# EAGLE design Servo (EAGLE 7.1.0)
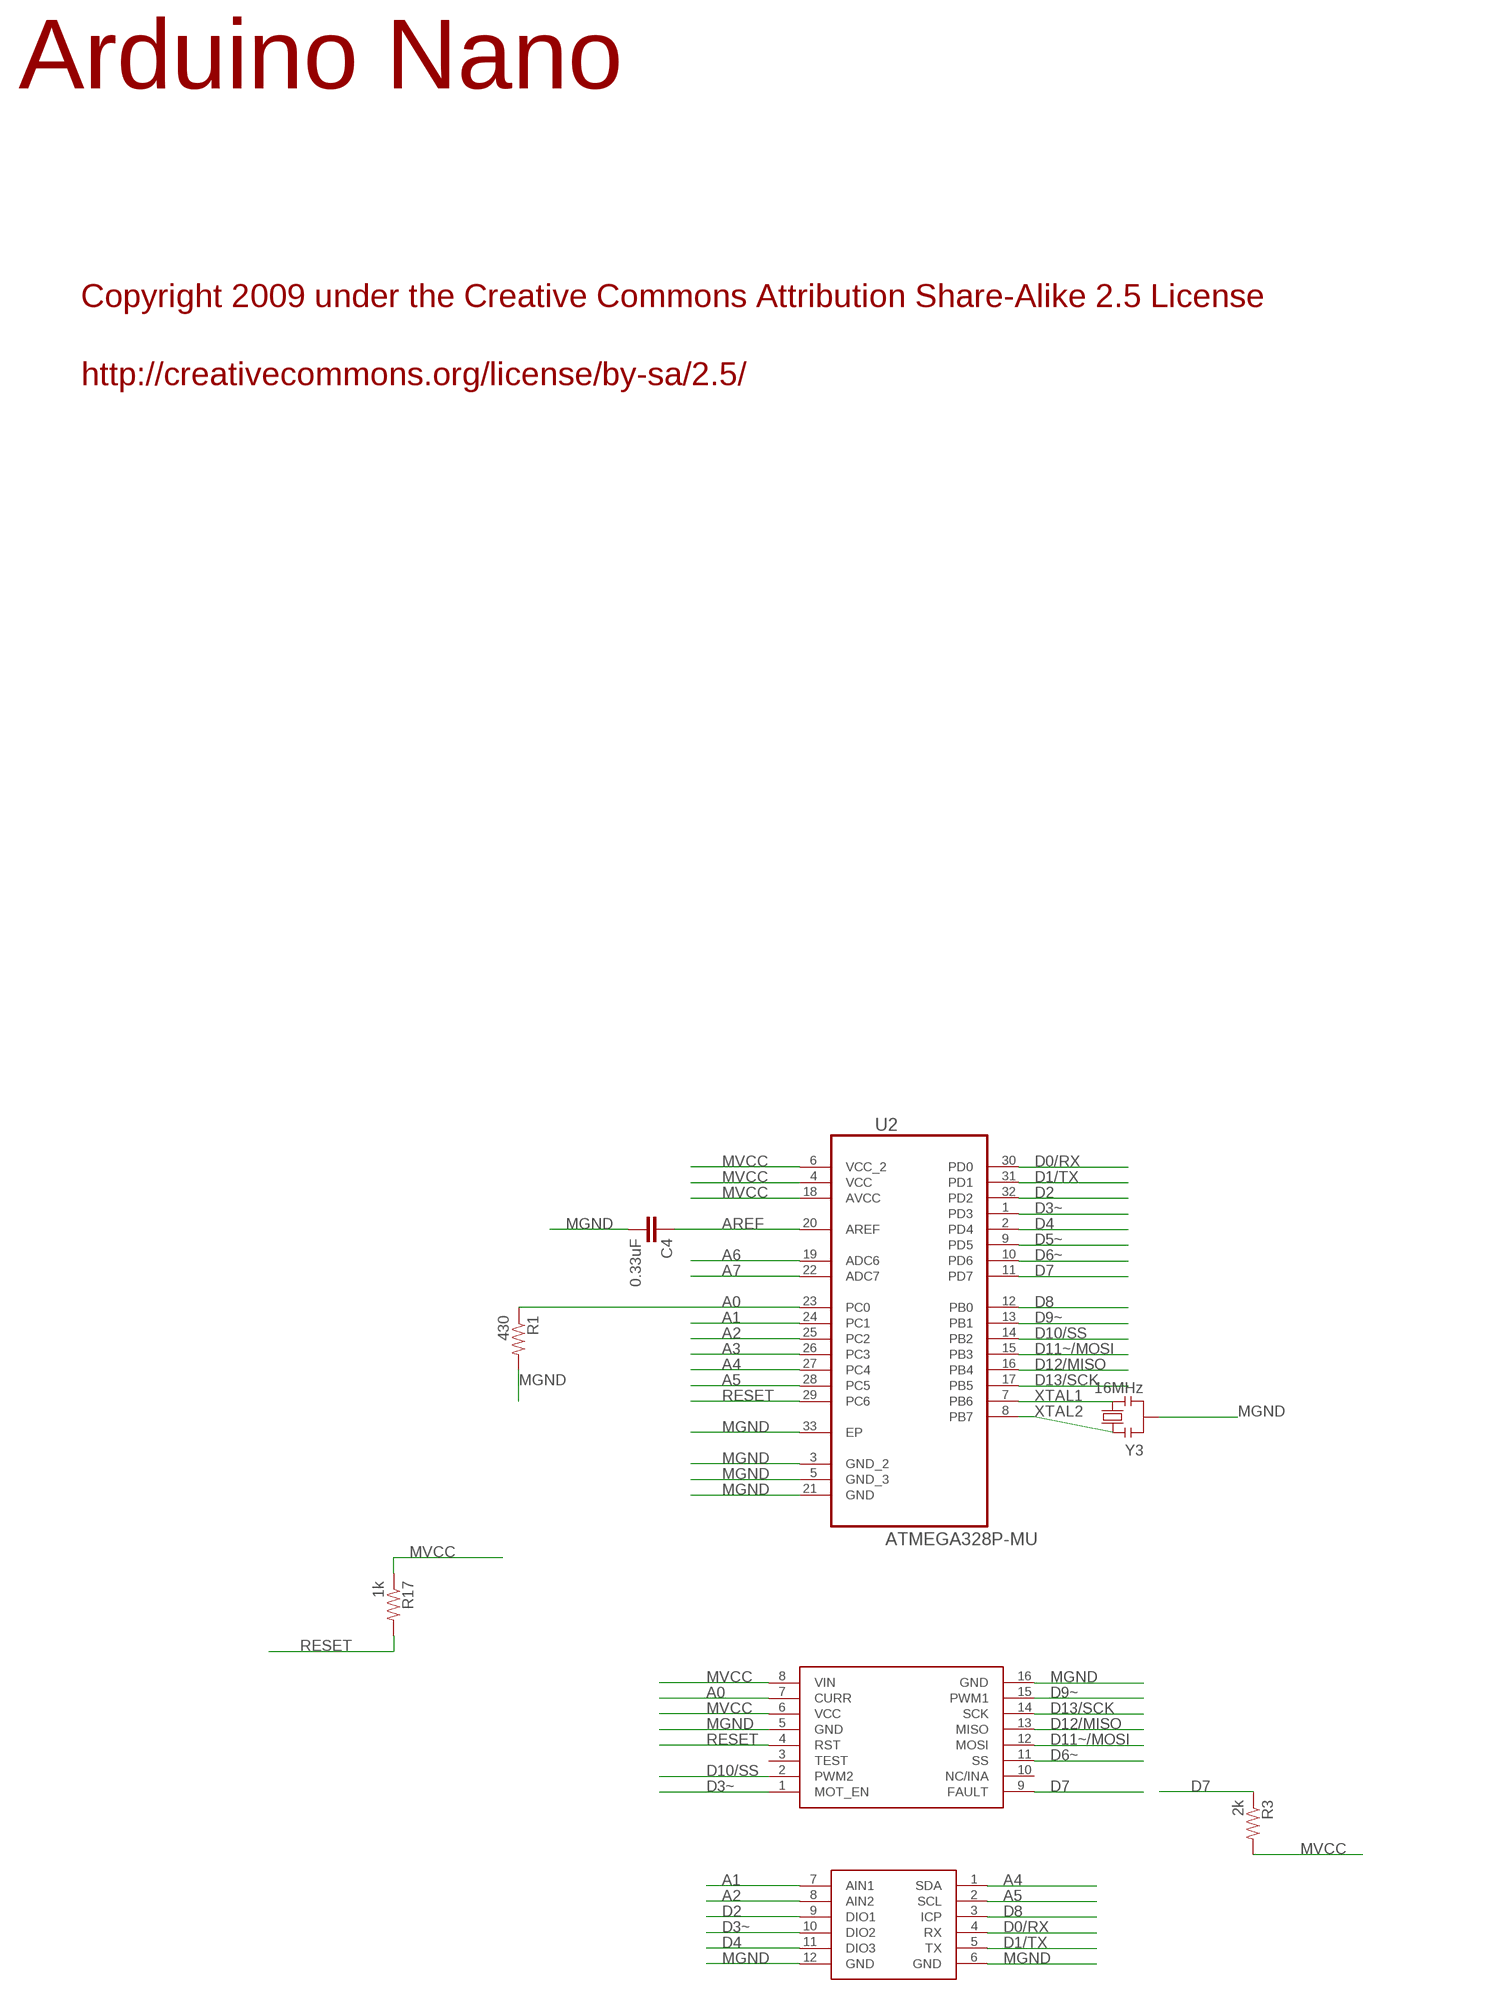
[diagram p0: schematic, sheet 1, part 1 of 2]
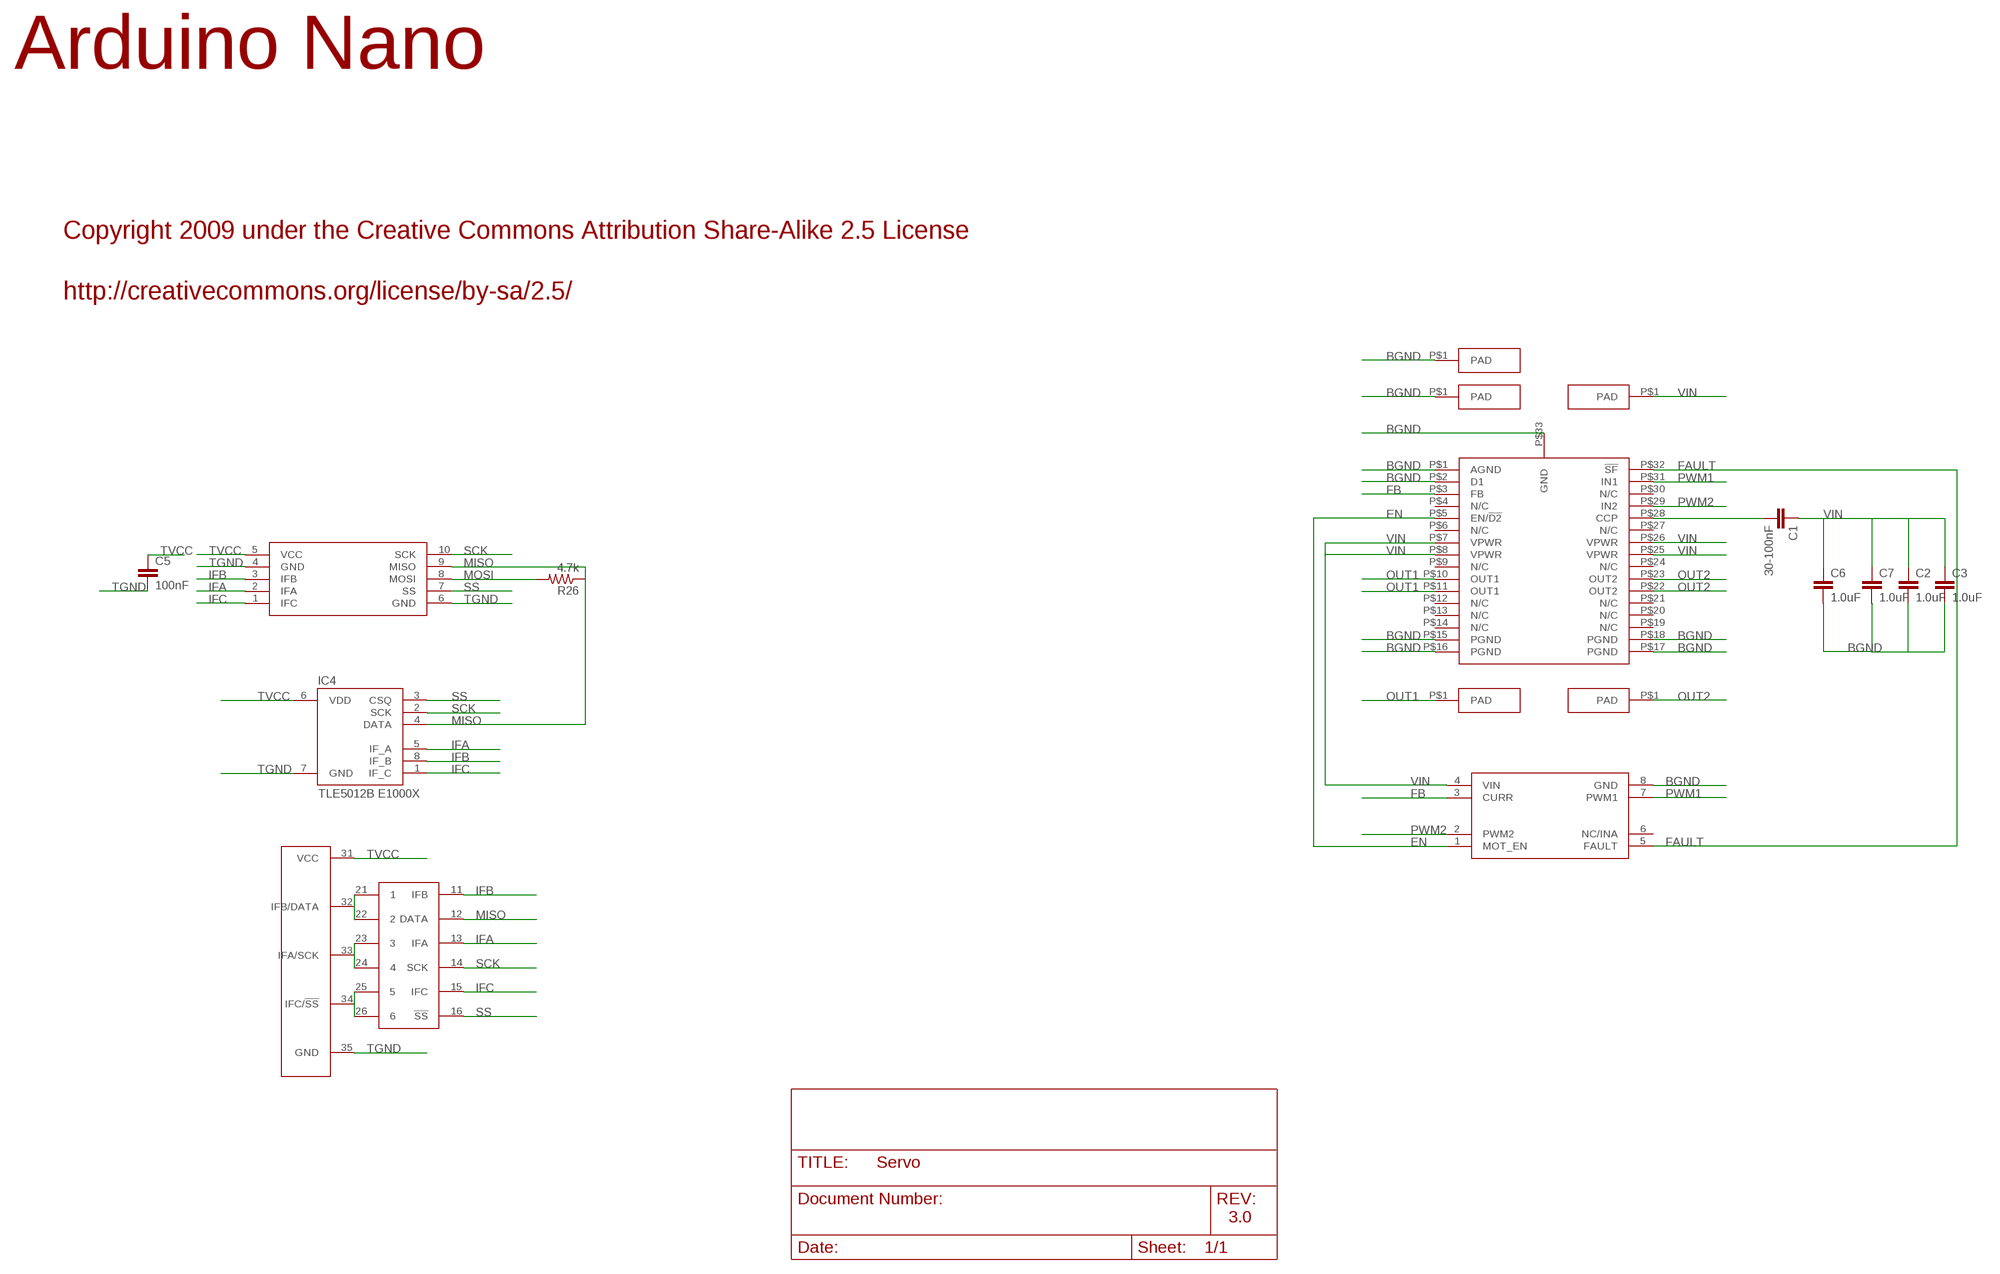
[diagram p1: schematic, sheet 1, part 2 of 2]

## Parts
C1  30-100nF  0.33UF-50V-10%(0805)  [0805-CAP]
C2  1.0uF  1.0UF50V10%(1206)  [1206-CAP]
C3  1.0uF  1.0UF50V10%(1206)  [1206-CAP]
C4  0.33uF  0.33UF-50V-10%(0805)  [0805-CAP]
C5  100nF  0.33UF-50V-10%(0805)  [0805-CAP]
C6  1.0uF  1.0UF50V10%(1206)  [1206-CAP]
C7  1.0uF  1.0UF50V10%(1206)  [1206-CAP]
IC4  TLE5012B E1000X  TLE5012B  [SO08]
R1  430  0.05OHM-1/5W-1%(0603)  [0603]
R3  2k  0.05OHM-1/5W-1%(0603)  [0603]
R17  1k  0.05OHM-1/5W-1%(0603)  [0603]
R26  4.7k  0.05OHM-1/5W-1%(0603)  [0603]
U2  ATMEGA328P-MU  [QFN50P500X500X100-33N]
U$1  MIDDLE  [MIDDLE2]
U$2  TOP  [TOP]
U$3  BOTTOM  [BOTTOM]
U$4  MC34931EK  [MC34931EK]
U$5  PAD  [PAD]
U$6  PAD  [PAD]
U$7  PAD  [PAD]
U$8  PAD  [PAD]
U$10  MIDDLE3  [MIDDLE3]
U$13  TOP2  [TOP2]
U$14  PAD  [PAD]
Y3  16MHz  RESONATORMU  [RESONATOR]

## Nets
A0: R1.1 U2.23(PC0) U$1.7(CURR)
A1: U2.24(PC1) U$10.7(AIN1)
A2: U2.25(PC2) U$10.8(AIN2)
A3: U2.26(PC3)
A4: U2.27(PC4) U$10.1(SDA)
A5: U2.28(PC5) U$10.2(SCL)
A6: U2.19(ADC6)
A7: U2.22(ADC7)
AREF: C4.1 U2.20(AREF)
BGND: C2.2 C3.2 C6.2 C7.2 U$3.8(GND) U$4.P$1(AGND) U$4.P$2(D1) U$4.P$15(PGND) U$4.P$16(PGND) U$4.P$17(PGND) U$4.P$18(PGND) U$4.P$33(GND) U$7.P$1(PAD) U$14.P$1(PAD)
D0/RX: U2.30(PD0) U$10.4(RX)
D1/TX: U2.31(PD1) U$10.5(TX)
D2: U2.32(PD2) U$10.9(DIO1)
D3~: U2.1(PD3) U$1.1(MOT_EN) U$10.10(DIO2)
D4: U2.2(PD4) U$10.11(DIO3)
D5~: U2.9(PD5)
D6~: U2.10(PD6) U$1.11(SS)
D7: R3.1 U2.11(PD7) U$1.9(FAULT)
D8: U2.12(PB0) U$10.3(ICP)
D9~: U2.13(PB1) U$1.15(PWM1)
D10/SS: U2.14(PB2) U$1.2(PWM2)
D11~/MOSI: U2.15(PB3) U$1.12(MOSI)
D12/MISO: U2.16(PB4) U$1.13(MISO)
D13/SCK: U2.17(PB5) U$1.14(SCK)
EN: U$3.1(MOT_EN) U$4.P$5(EN/!D2)
FAULT: U$3.5(FAULT) U$4.P$32(!SF)
FB: U$3.3(CURR) U$4.P$3(FB)
IFA: IC4.5(IF_A) U$2.2(IFA) U$13.13(IFA)
IFB: IC4.8(IF_B) U$2.3(IFB) U$13.11(IFB)
IFC: IC4.1(IF_C) U$2.1(IFC) U$13.15(IFC)
MGND: C4.2 R1.2 U2.3(GND_2) U2.5(GND_3) U2.21(GND) U2.33(EP) U$1.5(GND) U$1.16(GND) U$10.6(GND) U$10.12(GND) Y3.2
MISO: IC4.4(DATA) R26.1 U$2.9(MISO) U$13.12(DATA)
MOSI: R26.2 U$2.8(MOSI)
MVCC: R3.2 R17.1 U2.4(VCC) U2.6(VCC_2) U2.18(AVCC) U$1.6(VCC) U$1.8(VIN)
N$1: U$13.21 U$13.22 U$13.32(IFB/DATA)
N$2: U$13.23 U$13.24 U$13.33(IFA/SCK)
N$3: U$13.25 U$13.26 U$13.34(IFC/!SS)
N$29: C1.2 U$4.P$28(CCP)
OUT1: U$4.P$10(OUT1) U$4.P$11(OUT1) U$6.P$1(PAD)
OUT2: U$4.P$22(OUT2) U$4.P$23(OUT2) U$5.P$1(PAD)
PWM1: U$3.7(PWM1) U$4.P$31(IN1)
PWM2: U$3.2(PWM2) U$4.P$29(IN2)
RESET: R17.2 U2.29(PC6) U$1.4(RST)
SCK: IC4.2(SCK) U$2.10(SCK) U$13.14(SCK)
SS: IC4.3(CSQ) U$2.7(SS) U$13.16(!SS)
TGND: C5.2 IC4.7(GND) U$2.4(GND) U$2.6(GND) U$13.35(GND)
TVCC: C5.1 IC4.6(VDD) U$2.5(VCC) U$13.31(VCC)
VIN: C1.1 C2.1 C3.1 C6.1 C7.1 U$3.4(VIN) U$4.P$7(VPWR) U$4.P$8(VPWR) U$4.P$25(VPWR) U$4.P$26(VPWR) U$8.P$1(PAD)
XTAL1: U2.7(PB6) Y3.3
XTAL2: U2.8(PB7) Y3.1
Unconnected: U$1.3(TEST) U$1.10(NC/INA) U$3.6(NC/INA) U$4.P$4(N/C) U$4.P$6(N/C) U$4.P$9(N/C) U$4.P$12(N/C) U$4.P$13(N/C) U$4.P$14(N/C) U$4.P$19(N/C) U$4.P$20(N/C) U$4.P$21(N/C) U$4.P$24(N/C) U$4.P$27(N/C) U$4.P$30(N/C)

## Notes on the sheet
- Arduino Nano
- Arduino Nano
- Copyright 2009 under the Creative Commons Attribution Share-Alike 2.5 License
- http://creativecommons.org/license/by-sa/2.5/
- Copyright 2009 under the Creative Commons Attribution Share-Alike 2.5 License
- http://creativecommons.org/license/by-sa/2.5/
- 3.0

## Library data of the parts
C1 C5 = SparkFun-Capacitors:0.33UF-50V-10%(0805): CAP-08469; PROD_ID: CAP-08469; VALUE: 0.33uF
C2 C3 C6 C7 = SparkFun-Capacitors:1.0UF50V10%(1206): CAP-09822; PROD_ID: CAP-09822
C4 = SparkFun-Capacitors:0.33UF-50V-10%(0805): CAP-08469; PROD_ID: CAP-08469
IC4 = # stdlib:TLE5012B
R1 R3 R17 R26 = SparkFun-Resistors:0.05OHM-1/5W-1%(0603); PROD_ID: RES-12535
U2 = Atmel_By_element14_Batch_1-00:ATMEGA328P-MU: Programmable Flash; MPN: ATMEGA328P-MU; OC_FARNELL: 1748522; OC_NEWARK: 26R2526; PACKAGE: QFN-32; SUPPLIER: Atmel
U$1 = Servo:MIDDLE
U$2 = Servo:TOP
U$3 = Servo:BOTTOM
U$4 = Servo:MC34931EK
U$5-U$8 U$14 = Servo:PAD
U$10 = Servo:MIDDLE3
U$13 = Servo:TOP2
Y3 = MySMD2:RESONATOR

## Board
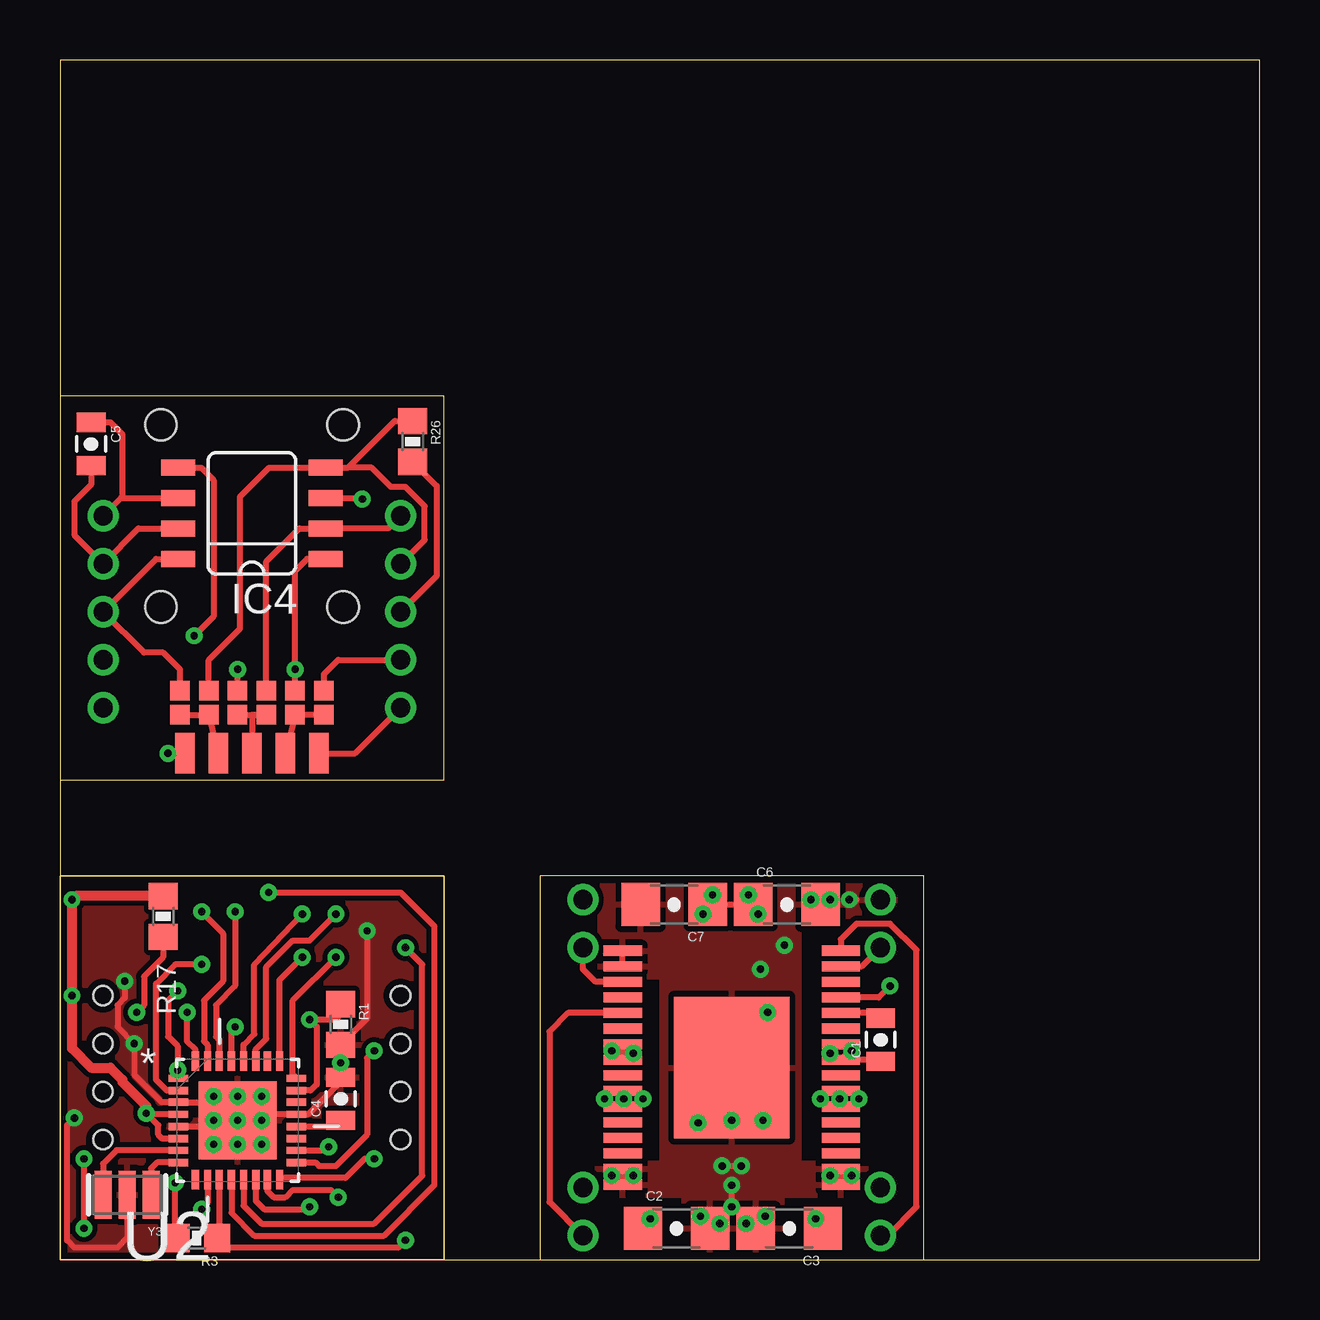
[diagram p2: board, top side]
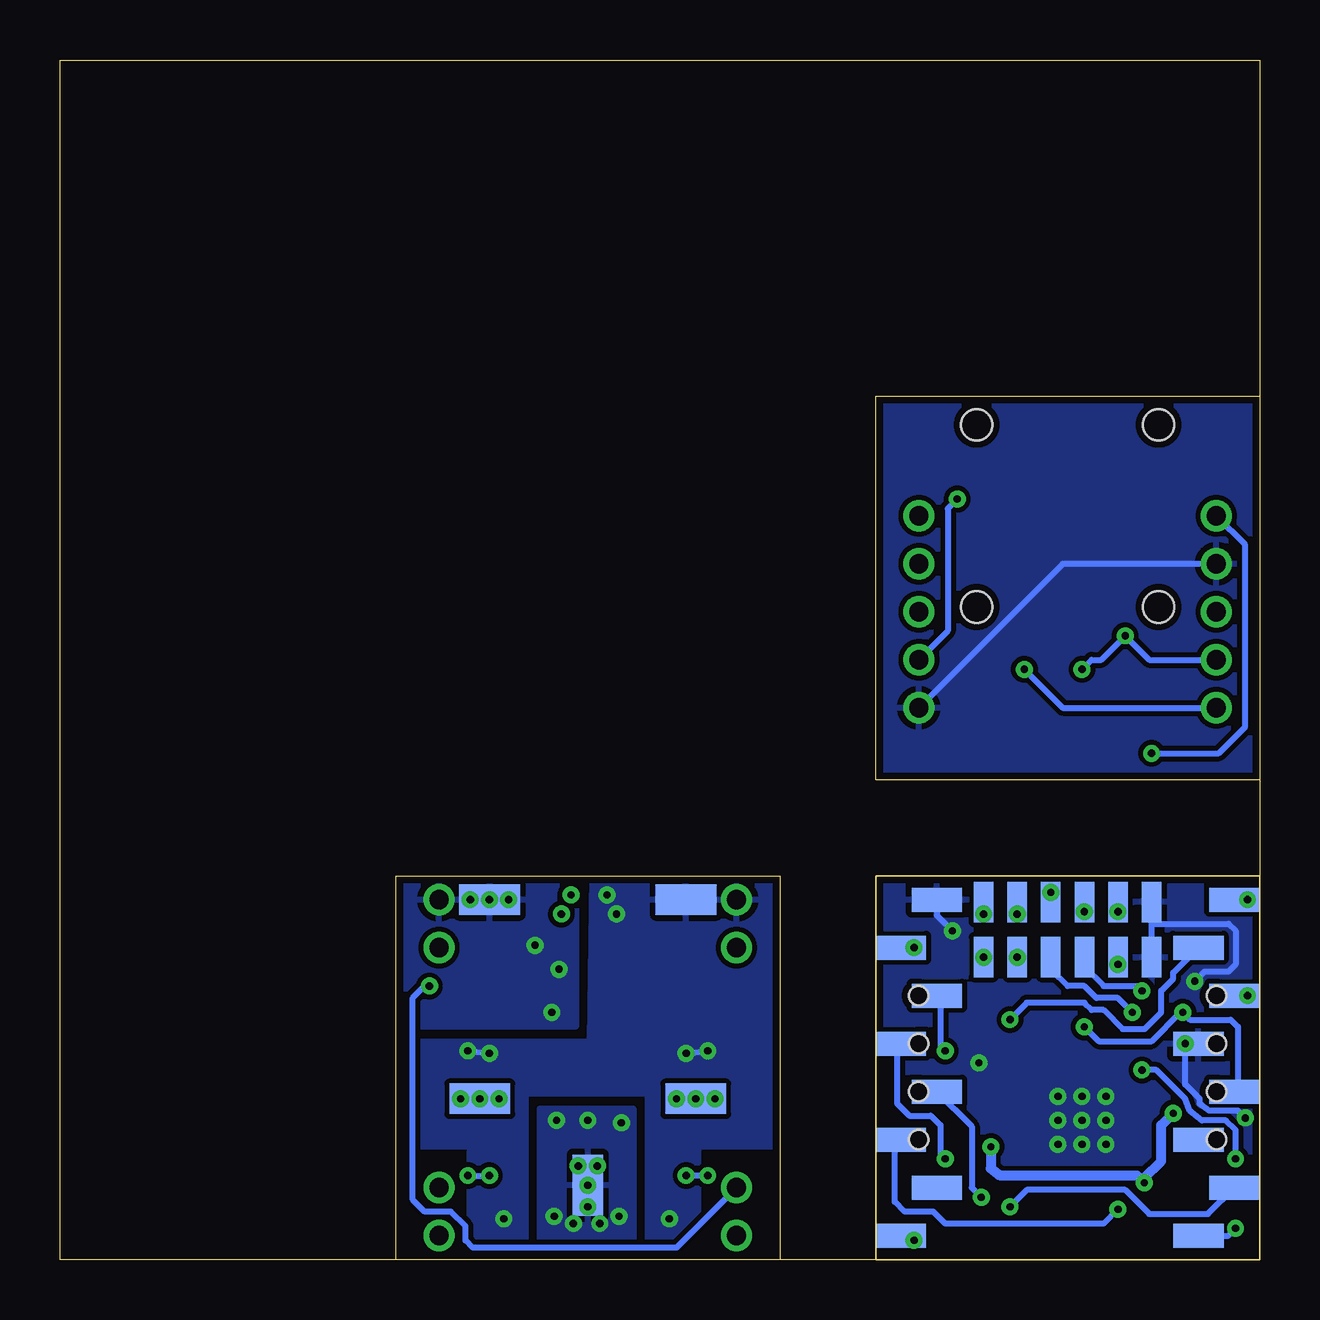
[diagram p3: board, bottom side, seen from below]

Size 50 x 50 mm. Coordinates in mm from the lower left corner, seen from the top.
Outline: 0,0 50,0 50,50 0,50 0,0
Copper layers (1*16): Top 0.035mm / dielectric 1.2mm / Bottom 0.035mm
Design rules "defaultjelle": minimum track width 10mil, minimum drill 13mil, track to track 8mil, track to pad 8mil, pad to pad 8mil, via to via 8mil, smd to smd 8mil, copper to edge 0.3mm, drill to drill 0.25mm, minimum pad ring 10mil, minimum via ring 8mil, stop-mask expansion 4mil, vias tented up to drill 0mil, thermal gap 10mil
Holes 1.3 mm at 4.2,34.8 11.8,34.8 11.8,27.2 4.2,27.2

### Footprints (pad centres in the part's own frame; a part is rotated, then mirrored left to right if it is on the bottom)
0805-CAP = smd 0.8 x 1.2: 1 -0.9,0; 2 0.9,0
1206-CAP = smd 1.6 x 1.8: 1 -1.4,0; 2 1.4,0
SO08 = smd 0.66 x 1.397: 1 0,-3.073; 2 1.27,-3.073; 3 2.54,-3.073; 4 3.81,-3.073; 5 3.81,3.073; 6 2.54,3.073; 7 1.27,3.073; 8 0,3.073
0603 = smd 1.1 x 1.2: 1 -0.85,0; 2 0.85,0
QFN50P500X500X100-33N = smd 0.813 x 0.305: 1 -2.464,1.753; 2 -2.464,1.245; 3 -2.464,0.762; 4 -2.464,0.254; 5 -2.464,-0.254; 6 -2.464,-0.762; 7 -2.464,-1.245; 8 -2.464,-1.753; 17 2.464,-1.753; 18 2.464,-1.245; 19 2.464,-0.762; 20 2.464,-0.254; 21 2.464,0.254; 22 2.464,0.762; 23 2.464,1.245; 24 2.464,1.753 | smd 0.305 x 0.813: 9 -1.753,-2.464; 10 -1.245,-2.464; 11 -0.762,-2.464; 12 -0.254,-2.464; 13 0.254,-2.464; 14 0.762,-2.464; 15 1.245,-2.464; 16 1.753,-2.464; 25 1.753,2.464; 26 1.245,2.464; 27 0.762,2.464; 28 0.254,2.464; 29 -0.254,2.464; 30 -0.762,2.464; 31 -1.245,2.464; 32 -1.753,2.464 | smd 3.251 x 3.251: 33 0,0
MIDDLE2 = smd 2.1 x 1 bottom: 1 2.55,1; 2 1.05,3; 3 2.55,5; 4 1.05,7; 5 2.55,9; 6 1.05,11; 7 2.55,13; 8 1.05,15; 9 14.95,1; 10 13.45,3; 11 14.95,5; 12 13.45,7; 13 14.95,9; 14 13.45,11; 15 14.95,13; 16 13.45,15 | hole 0.8: 1.8,11; 1.8,9; 1.8,7; 1.8,5; 14.2,5; 14.2,7; 14.2,9; 14.2,11
TOP = drill 0.8: 1 1.8,3; 2 1.8,5; 3 1.8,7; 4 1.8,9; 5 1.8,11; 6 14.2,3; 7 14.2,5; 8 14.2,7; 9 14.2,9; 10 14.2,11
BOTTOM = drill 0.8: 1 1.8,1; 2 1.8,3; 3 1.8,13; 4 1.8,15; 5 14.2,1; 6 14.2,3; 7 14.2,13; 8 14.2,15
MC34931EK = smd 1.6 x 0.42: P$1 -4.55,4.875; P$2 -4.55,4.225; P$3 -4.55,3.575; P$4 -4.55,2.925; P$5 -4.55,2.275; P$6 -4.55,1.625; P$7 -4.55,0.975; P$8 -4.55,0.325; P$9 -4.55,-0.325; P$10 -4.55,-0.975; P$11 -4.55,-1.625; P$12 -4.55,-2.275; P$13 -4.55,-2.925; P$14 -4.55,-3.575; P$15 -4.55,-4.225; P$16 -4.55,-4.875; P$17 4.55,-4.875; P$18 4.55,-4.225; P$19 4.55,-3.575; P$20 4.55,-2.925; P$21 4.55,-2.275; P$22 4.55,-1.625; P$23 4.55,-0.975; P$24 4.55,-0.325; P$25 4.55,0.325; P$26 4.55,0.975; P$27 4.55,1.625; P$28 4.55,2.275; P$29 4.55,2.925; P$30 4.55,3.575; P$31 4.55,4.225; P$32 4.55,4.875 | smd 4.8 x 5.9: P$33 0,0
PAD = smd 2.54 x 1.27: P$1 0,0
MIDDLE3 = smd 0.813 x 1.676: 1 4.5,14.9; 2 5.9,14.9; 3 7.3,14.9; 4 8.7,14.9; 5 10.1,14.9; 6 11.5,14.9; 7 4.5,12.6; 8 5.9,12.6; 9 7.3,12.6; 10 8.7,12.6; 11 10.1,12.6; 12 11.5,12.6
TOP2 = smd 0.813 x 0.813: 11 5,3.7; 12 6.2,3.7; 13 7.4,3.7; 14 8.6,3.7; 15 9.8,3.7; 16 11,3.7; 21 5,2.7; 22 6.2,2.7; 23 7.4,2.7; 24 8.6,2.7; 25 9.8,2.7; 26 11,2.7 | smd 0.813 x 1.676: 31 5.2,1.1; 32 6.6,1.1; 33 8,1.1; 34 9.4,1.1; 35 10.8,1.1
RESONATOR = smd 0.7 x 2: 1 -1,0; 2 0,0; 3 1,0

### Placement (x,y rotation side)
C1  34.21,9.16 90 top
C2  25.7,1.3 0 top
C3  30.4,1.3 180 top
C4  11.7,6.7 90 top
C5  1.3,34 270 top
C6  30.3,14.8 0 top
C7  25.6,14.8 180 top
IC4  8,29.2 90 top
R1  11.7,9.8 270 top
R3  5.7,0.9 180 top
R17  4.3,14.3 270 top
R26  14.7,34.1 270 top
U2  7.4,5.8 0 top
U$1  0,0 0 top
U$2  0,20 0 top
U$3  20,0 0 top
U$4  28,8 0 top
U$5  32.5,6.7 0 bottom
U$6  23.5,6.7 0 bottom
U$7  32.1,15 0 bottom
U$8  23.9,15 0 bottom
U$10  16,0 0 bottom
U$13  0,20 0 top
U$14  28,3.1 270 bottom
Y3  2.8,2.7 180 top

### Tracks (layer width: path | path; a pad name or v marks a point on that pad's centre or on a via)
A0  (via drill 0.3)
  Top 0.254: U2.23 10.45,7.04 10.7,7.3 10.7,9.7 v10.4,10 11.55,10 R1.1
  Bottom 0.254: U$1.7 3.6,11.95 3.6,11.7 4.1,11.2 4.1,10.3 4.8,9.6 5.7,9.6 6.5,10.4 7,10.4 7.3,10.7 9.7,10.7 v10.4,10
A1  (via drill 0.3)
  Top 0.254: U2.24 9.7,7.72 9.7,10.8 U$10.7
  other vias: 11.5,12.6
A2  (via drill 0.3)
  Top 0.254: U2.25 9.15,11.65 U$10.8
  other vias: 10.1,12.6
A4  (via drill 0.3)
  Top 0.254: U2.27 8.16,8.76 8.6,9.2 8.6,12.2 9.7,13.3 10.4,13.3 v11.5,14.4
  Bottom 0.254: v11.5,14.4 U$10.1
A5  (via drill 0.3)
  Top 0.254: U2.28 7.65,8.95 8.1,9.4 8.1,12.3 v10.1,14.4
  Bottom 0.254: v10.1,14.4 U$10.2
AREF
  Top 0.254: U2.20 11.35,5.55 C4.1
BGND  (via drill 0.3)
  Top 0.254: U$4.P$2 U$4.P$1 | U$4.P$15 U$4.P$16 23.07,3.5 v23,3.5 | U$4.P$18 U$4.P$17 32.92,3.5 v33,3.5 | v23.9,3.5 23.7,3.7 23.4,3.7 | v32.1,3.5 32.4,3.8 32.6,3.8 | v28,2.2 U$14.P$1 | v27.6,3.9 v28.4,3.9 | v31.3,15 U$7.P$1 | v32.9,15 33.2,15
  Bottom 0.254: v23,3.5 v23.9,3.5 | v33,3.5 v32.1,3.5 | v28,2.2 U$14.P$1 v27.6,3.9 | v28.4,3.9 28,4.2 | v31.3,15 U$7.P$1 v32.9,15
  other vias: 28,3.1 32.1,15 27.5,1.5 28.6,1.5 29.4,1.8 26.7,1.8 28,5.8 26.6,5.7 29.3,5.8 29.5,10.3 29.2,12.1 30.2,13.1
  pour Top: 22.4,2.7 26,2.7 26,0 30.1,0 30.1,2.7 33.6,2.7 33.6,4 30.8,4 30.8,14.3 34.8,14.3 34.8,15.8 22.5,15.8 22.5,11.8 25.1,11.8 25.1,4 22.4,4
  pour Bottom: 26.1,0 30,0 30,6.3 26.1,6.3
  pour Bottom: 36,16 28.5,16 28.5,9.7 36,9.7
D0/RX  (via drill 0.3)
  Top 0.254: v7.3,14.5 7.3,11.4 6.5,10.6 6.5,9.3 6.64,9.16 U2.30
  Bottom 0.254: U$10.4 v7.3,14.5
D1/TX  (via drill 0.3)
  Top 0.254: v5.9,14.5 6.8,13.6 6.8,11.6 6,10.8 6,9.1 6.16,8.95 U2.31
  Bottom 0.254: U$10.5 v5.9,14.5
D2  (via drill 0.3)
  Top 0.254: U2.32 5.65,8.75 5.3,9.1 v5.3,10.3
  Bottom 0.254: v5.3,10.3 5.9,10.9 6.8,10.9 7.3,11.4 8,11.4 8.7,12.1 U$10.9
D3~  (via drill 0.3)
  Top 0.254: U2.1 4.9,8.19 v4.9,7.9 4.9,8.9 4.5,9.3 4.5,10.8 v4.9,11.2 | v1,1.3 v1,4.2
  Bottom 0.254: U$10.10 7.3,12.2 6.5,11.4 5.1,11.4 v4.9,11.2 | v4.9,7.9 4.3,7.9 3.1,6.7 2.9,6.2 2.4,5.8 1.4,5.8 1,5.4 v1,4.2 | U$1.1 1.3,1 v1,1.3
D4  (via drill 0.3)
  Top 0.254: v5.9,12.3 4.8,12.3 4,11.5 4,7.5 4.46,7.04 U2.2
  Bottom 0.254: U$10.11 v5.9,12.3
D6~  (via drill 0.3)
  Top 0.254: U2.10 6.16,2.35 v5.9,2.1
  Bottom 0.254: v5.9,2.1 6.5,1.5 13.1,1.5 13.6,2 14.8,2 15.2,2.4 15.2,4.75 U$1.11
D7  (via drill 0.3)
  Top 0.254: U2.11 6.64,1.49 R3.1 6.85,0.5 14.1,0.5 v14.4,0.8
  Bottom 0.254: U$1.9 14.6,1 v14.4,0.8
D8  (via drill 0.3)
  Top 0.254: v8.7,15.3 14.2,15.3 15.6,13.9 15.6,3.1 13.5,1 8.1,1 7.15,1.95 U2.12
  Bottom 0.254: U$10.3 v8.7,15.3
D9~  (via drill 0.3)
  Top 0.254: U2.13 7.65,2.25 8.4,1.5 13.1,1.5 15.1,3.5 15.1,12.3 v14.4,13
  Bottom 0.254: U$1.15 v14.4,13
D10/SS  (via drill 0.3)
  Top 0.254: U2.14 8.16,2.44 8.5,2.1 10.3,2.1 v10.4,2.2
  Bottom 0.254: v10.4,2.2 9.7,2.9 5.6,2.9 4.6,1.9 2.15,1.9 U$1.2
D11~/MOSI  (via drill 0.3)
  Top 0.254: U2.15 8.64,2.85 8.9,2.6 9.4,2.6 9.7,2.9 11.3,2.9 v11.6,2.6
  Bottom 0.254: U$1.12 12,5.55 12,3 v11.6,2.6
D12/MISO  (via drill 0.3)
  Top 0.254: v13.1,4.2 12.7,4.2 11.9,3.4 9.22,3.4 U2.16
  Bottom 0.254: v13.1,4.2 13.3,4.4 13.3,5.6 13.7,6 14.6,6 15.1,6.5 15.1,8.85 U$1.13
D13/SCK  (via drill 0.3)
  Top 0.254: U2.17 10.65,4.05 10.8,3.9 11.5,3.9 12.8,5.2 12.8,8.4 v13.1,8.7
  Bottom 0.254: U$1.14 13.3,10.85 13.3,8.9 v13.1,8.7
EN
  Top 0.254: U$4.P$5 21.18,10.28 20.4,9.5 20.4,2.4 U$3.1
FAULT
  Top 0.254: U$4.P$32 32.55,13.35 33.2,14 34.6,14 35.7,12.9 35.7,2.2 34.5,1 U$3.5
FB
  Top 0.254: U$4.P$3 22.32,11.57 21.8,12.1 U$3.3
IFA  (via drill 0.3)
  Top 0.254: U$13.13 v7.4,24.6 | IC4.5 5.89,33.01 6.4,32.5 6.4,26.8 v5.6,26
  Bottom 0.254: v7.4,24.6 7,25 6.6,25 v5.6,26 4.6,25 U$2.2
IFB
  Top 0.254: IC4.8 4,29.2 U$2.3 3.5,25.3 4.3,25.3 5,24.6 U$13.11
IFC  (via drill 0.3)
  Top 0.254: IC4.1 10.3,29.2 9.8,28.7 v9.8,24.6 U$13.15
  Bottom 0.254: v9.8,24.6 8.2,23 U$2.1
MGND  (via drill 0.3)
  Top 0.254: U2.33 7.65,6.05 U2.21 10.35,6.05 11.7,7.4 C4.2 v11.7,8.2 R1.2 12.8,10.05 v12.8,13.7 | U2.5 7.15,5.55 U2.33 | U2.33 6.64,6.56 U2.3 4.24,6.56 3.1,7.7 v3.1,9 2.4,9.7 2.4,10.6 2.7,10.9 v2.7,11.6 | Y3.2 2.8,0.9 2.4,0.5 0.6,0.5 0.3,0.8 0.3,5.6 v0.6,5.9
  Bottom 0.254: U$1.16 13.45,14.35 v12.8,13.7 | 4.5,14 U$10.6 | U$10.12 4.5,14 | 4.5,14 1.3,14 1,13.7 1,12.3 1.3,12 2.3,12 v2.7,11.6 | 3.1,9.05 U$1.5 v3.1,9 | 2.6,8.7 v3.1,9 | v0.6,5.9 0.9,6.2 2.1,6.2 2.5,6.5 2.5,6.7 3.1,7.3 v3.1,9
  other vias: 7.4,5.8 6.4,6.8 7.4,6.8 8.4,6.8 6.4,5.8 8.4,5.8 6.4,4.8 7.4,4.8 8.4,4.8
  pour Bottom: 0,16 16,16 16,0 0,0
  pour Top: 0,16.1 16,16.1 16,0 0,0
MISO
  Top 0.254: 12.01,33.01 IC4.4 8.71,33.01 7.5,31.8 7.5,26.3 6.2,25 U$13.12 | 12.01,33.01 13.95,34.95 R26.1 | U$2.9 15.2,30 15.2,31.4 14.4,32.2 13.8,32.2 12.99,33.01 12.01,33.01
MOSI
  Top 0.254: R26.2 15.7,32.25 15.7,28.5 U$2.8
MVCC  (via drill 0.3)
  Top 0.254: U2.18 11.04,4.55 v11.2,4.7 | R3.2 4.8,0.95 v4.8,3.2 | U2.4 3.65,6.05 v3.6,6.1 4.1,5.6 4.1,5.2 4.26,5.04 U2.6 | 0.65,15.15 v0.5,15
  Top 0.406: R17.1 0.65,15.15 | v0.5,15 v0.5,11 0.5,8.8 1.3,8 2.1,8 2.6,7.5 2.6,7.4 3.6,6.4 v3.6,6.1
  Bottom 0.254: 4.8,3.4 5.1,3.5 | v0.5,15 U$1.8 1.05,14.75 | U$1.6 v0.5,11
  Bottom 0.406: v11.2,4.7 11.2,3.8 10.8,3.5 5.1,3.5 v4.8,3.2 | 4.8,3.4 4.1,4.1 4.1,5.6 v3.6,6.1
N$1
  Top 0.254: U$13.21 U$13.22 U$13.32
N$2
  Top 0.254: U$13.23 U$13.24 8,22.7 U$13.33
N$3
  Top 0.254: U$13.26 U$13.25 U$13.34
N$29
  Top 0.254: C1.2 34,10.28 U$4.P$28
OUT1  (via drill 0.3)
  Top 0.254: v22.7,6.7 23.02,6.38 U$4.P$11 24.07,6.38 v24.3,6.7 | U$4.P$10 23.45,6.85 U$6.P$1
  Bottom 0.254: v24.3,6.7 U$6.P$1
  other vias: 23.5,6.7
OUT2  (via drill 0.3)
  Top 0.254: v31.7,6.7 31.93,7.03 U$4.P$23 32.55,6.85 U$5.P$1 32.55,6.55 U$4.P$22 32.98,6.38 v33.3,6.7
  Bottom 0.254: v31.7,6.7 32.23,6.7
  other vias: 32.5,6.7
PWM1
  Top 0.254: U$4.P$31 33.42,12.22 U$3.7
PWM2  (via drill 0.3)
  Top 0.254: v34.6,11.4 34.12,10.93 U$4.P$29
  Bottom 0.254: U$3.2 24.3,0.5 32.8,0.5 33.1,0.8 33.1,1.4 33.7,2 34.8,2 35.3,2.5 35.3,10.9 34.8,11.4 v34.6,11.4
RESET  (via drill 0.3)
  Top 0.254: U2.29 7.15,9.55 v7.3,9.7 | R17.2 4.3,12.6 3.5,11.8 3.5,10.6 v3.2,10.3
  Bottom 0.254: 1,7.05 U$1.4 0.9,7.15 0.9,9.7 1.2,10 2.9,10 v3.2,10.3 3.3,10.3 4.5,9.1 6.7,9.1 v7.3,9.7
SCK
  Top 0.254: U$2.10 13.67,30.47 IC4.2 9.97,30.47 8.6,29.1 U$13.14
SS  (via drill 0.3)
  Top 0.254: U$13.16 11,24.4 11.6,25 U$2.7 | IC4.3 12.56,31.74 v12.6,31.7
  Bottom 0.254: v12.6,31.7 13,31.3 13,26.2 U$2.7
TGND
  Top 0.254: IC4.7 3.27,30.47 U$2.4 0.6,30.2 0.6,31.6 1.3,32.3 C5.2 | U$13.35 12.3,21.1 U$2.6
  Bottom 0.254: U$2.4 8.2,29 U$2.6
  pour Bottom: 0,20 16,20 16,36 0,36
TVCC  (via drill 0.3)
  Top 0.254: U$2.5 2.54,31.74 2.6,31.74 | 2.6,31.74 IC4.6 | C5.1 2.1,34.9 2.6,34.4 2.6,31.74 | U$13.31 v4.5,21.1
  Bottom 0.254: v4.5,21.1 1.7,21.1 0.6,22.2 0.6,29.8 U$2.5
VIN  (via drill 0.3)
  Top 0.254: U$4.P$8 U$4.P$7 | U$4.P$7 23.73,8.97 v23.9,8.6 | U$4.P$7 23.18,8.97 v23,8.7 | v33,8.7 32.92,8.7 U$4.P$25 34.15,8.32 C1.1 | v32.1,8.6 32.27,8.97 U$4.P$26 | C7.1 C6.1
  Top 0.406: v29.1,14.4 28.9,14.4 C6.1 28.9,15.2 v28.7,15.2 | v26.8,14.4 27,14.4 C7.1 | C2.1 24.6,1.3 v24.6,1.7 | C3.1 31.5,1.3 v31.5,1.7
  Bottom 0.254: v23.9,8.6 v23,8.7 | v33,8.7 v32.1,8.6
  other vias: 27.2,15.2
  pour Bottom: 27.8,16 20,16 20,4.7 23.4,4.7 23.4,0 25.5,0 25.5,6.9 30.6,6.9 30.6,0 32.9,0 32.9,4.7 36,4.7 36,9.1 27.9,9.1
XTAL1
  Top 0.254: U2.7 2.35,4.55 1.8,4 Y3.3
XTAL2
  Top 0.254: U2.8 4.05,4.05 3.8,3.8 Y3.1

### Text on the board
200bmp: E:/Documents/Hobby/Project Programmable Servo/TOP2.bmp
201bmp: E:/Documents/Hobby/Project Programmable Servo/MIDDLE.bmp
202bmp: E:/Documents/Hobby/Project Programmable Servo/MIDDLE2.bmp
203bmp: E:/Documents/Hobby/Project Programmable Servo/BOTTOM.bmp
204bmp: E:/Documents/Hobby/Project Programmable Servo/BOTTOM2.bmp